# EAGLE board Nixie Test (EAGLE 6.5.0)
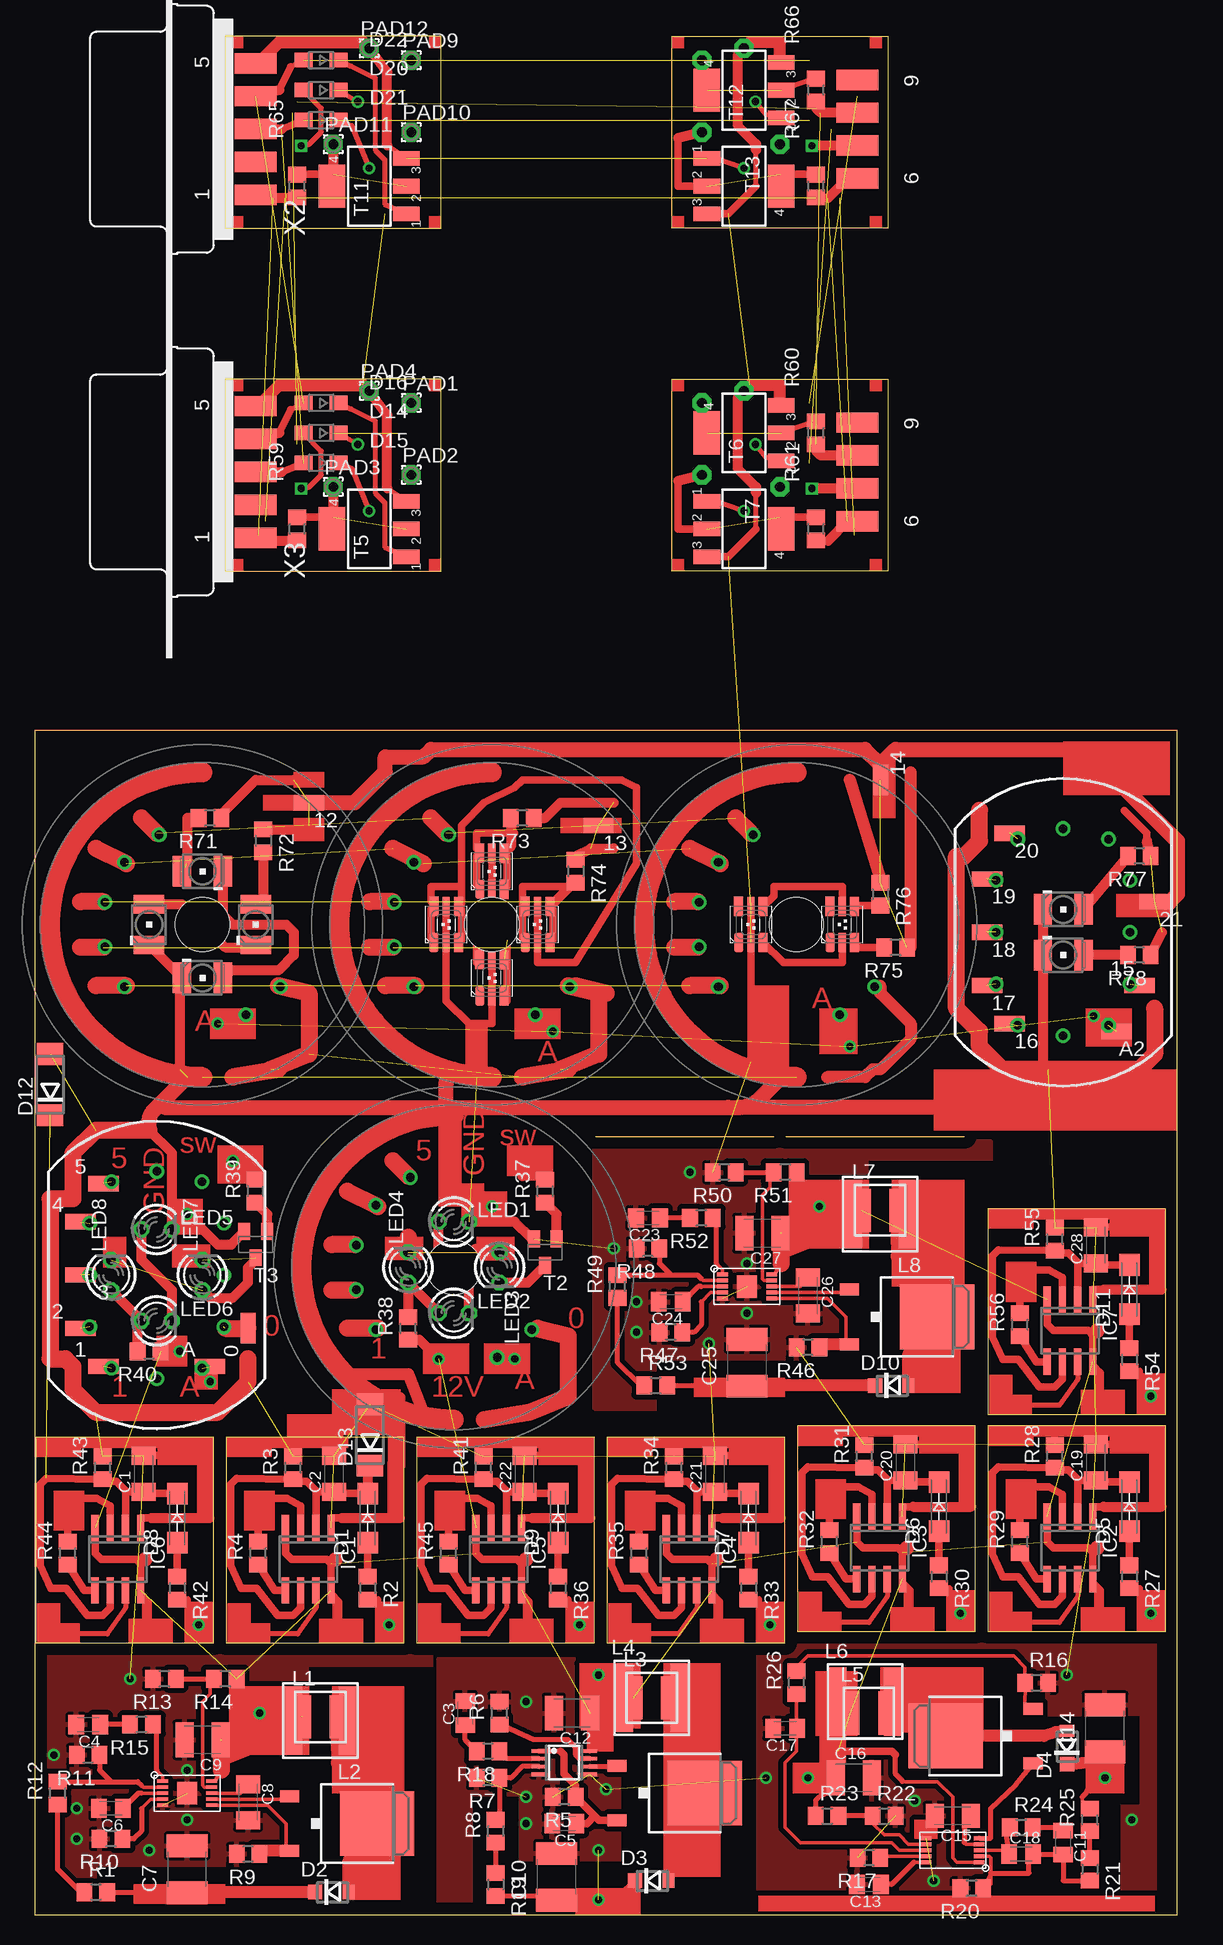
[diagram p17: board, top side]
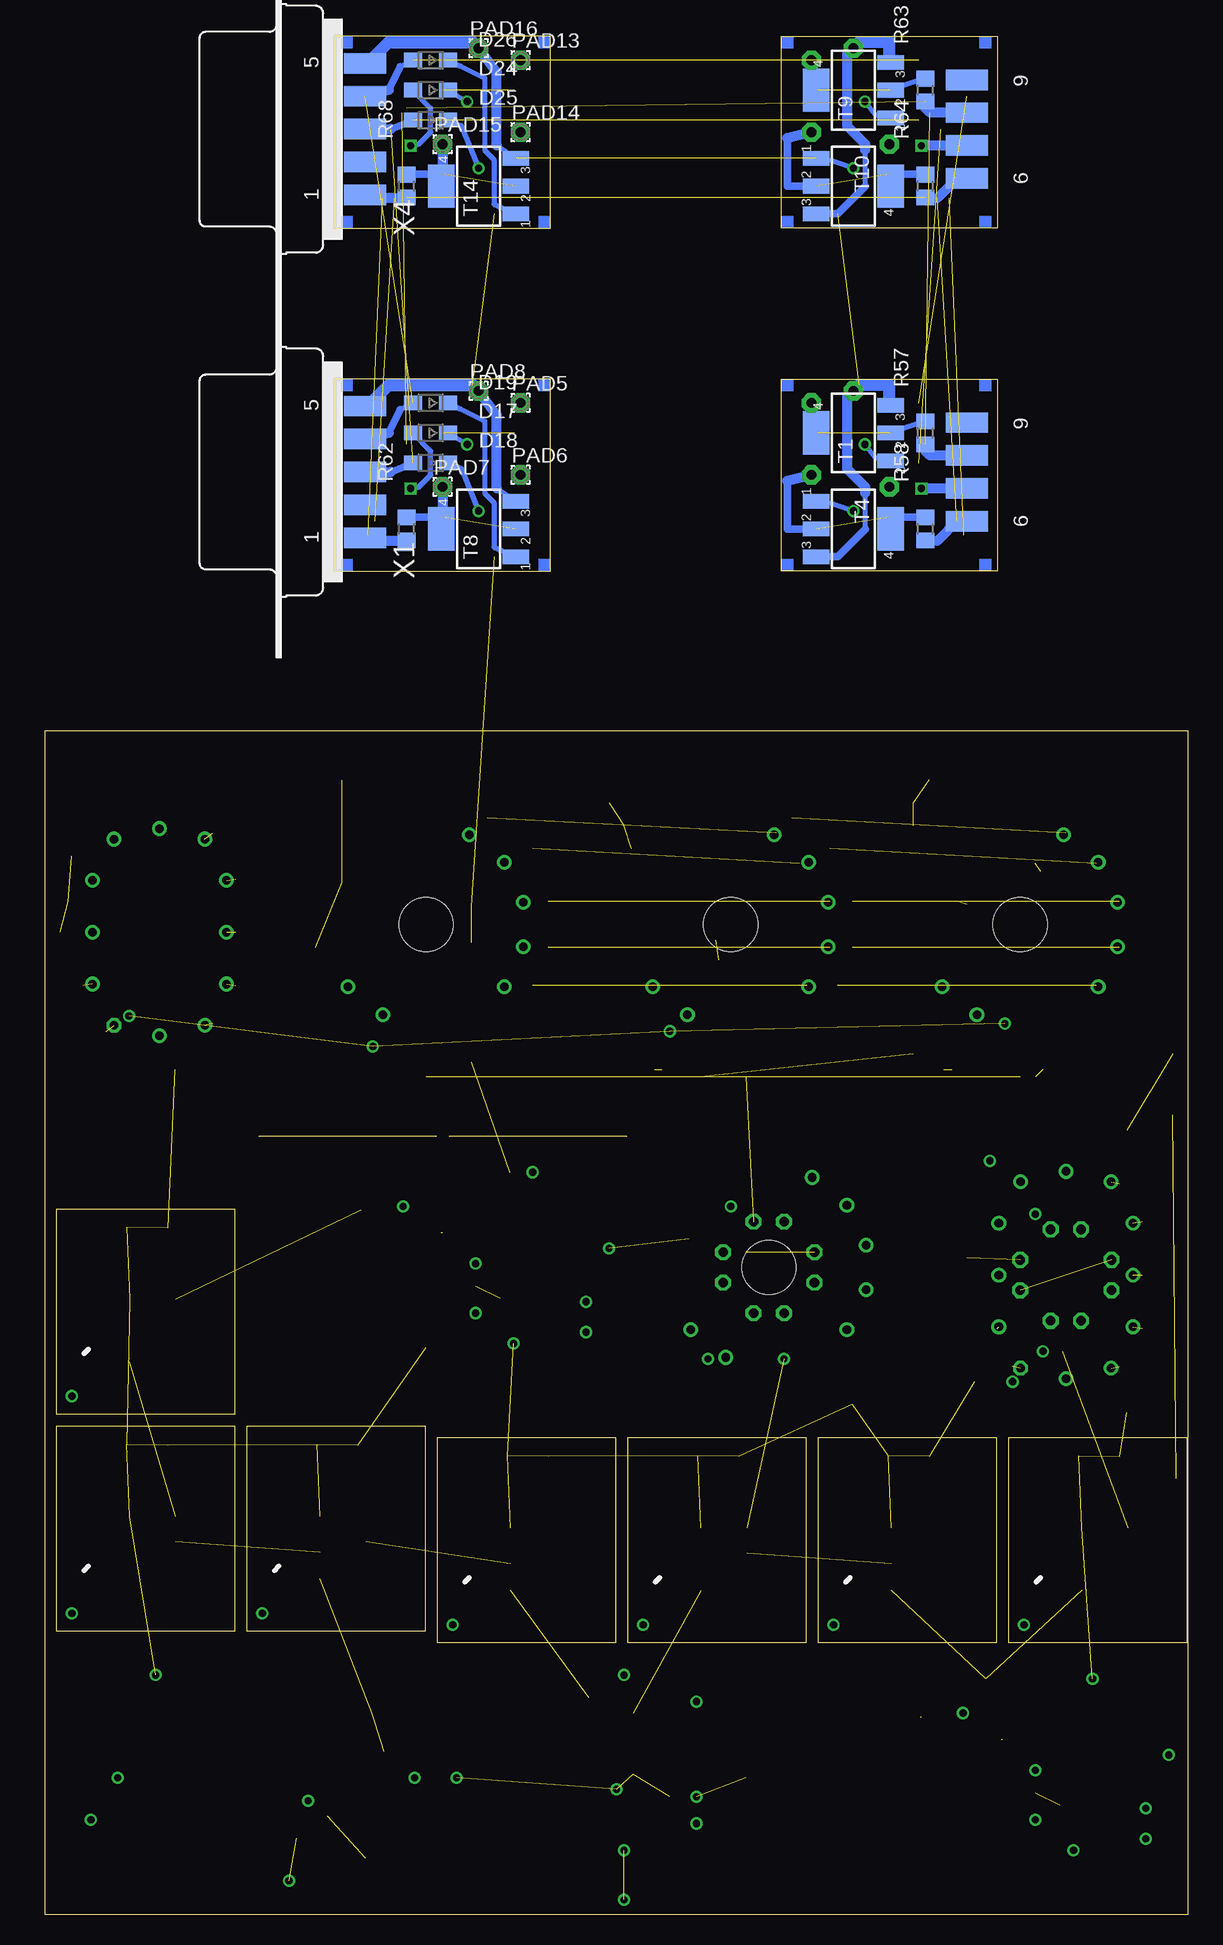
[diagram p18: board, bottom side, seen from below]

Size 95.23 x 156.6 mm. Coordinates in mm from the lower left corner, seen from the top.
Outline: 46.74,64.9 61.59,64.9
Outline: 62.61,64.9 77.47,64.9
Outline: 0,0 95.23,0 95.23,98.73 0,98.73 0,0
Outline: 14.92,39.81 0.06,39.81 0.06,22.67 14.92,22.67 14.92,39.81
Outline: 30.8,39.81 15.94,39.81 15.94,22.67 30.8,22.67 30.8,39.81
Outline: 94.3,40.77 79.44,40.77 79.44,23.62 94.3,23.62 94.3,40.77
Outline: 78.42,40.77 63.56,40.77 63.56,23.62 78.42,23.62 78.42,40.77
Outline: 62.55,39.81 47.69,39.81 47.69,22.67 62.55,22.67 62.55,39.81
Outline: 46.67,39.81 31.81,39.81 31.81,22.67 46.67,22.67 46.67,39.81
Outline: 94.3,58.86 79.44,58.86 79.44,41.72 94.3,41.72 94.3,58.86
Outline: 15.88,112.03 33.88,112.03 33.88,128.03 15.88,128.03 15.88,112.03
Outline: 71.12,112.03 53.12,112.03 53.12,128.03 71.12,128.03 71.12,112.03
Outline: 15.88,140.6 33.88,140.6 33.88,156.6 15.88,156.6 15.88,140.6
Outline: 71.12,140.6 53.12,140.6 53.12,156.6 71.12,156.6 71.12,140.6
Copper layers (1*16): Top 0.035mm / dielectric 1.5mm / Bottom 0.035mm
Design rules "default *": minimum track width 10mil, minimum drill 24mil, track to track 16mil, track to pad 8mil, pad to pad 8mil, via to via 8mil, smd to smd 8mil, copper to edge 40mil, drill to drill 8mil, minimum pad ring 10mil, minimum via ring 8mil, stop-mask expansion 4mil, vias tented up to drill 0mil, thermal gap 10mil
tRestrict: area 5.4,-0.3 to 32.7,12.4; area 22.9,12.1 to 33,20.6; area 36.8,14.6 to 37.8,17.1; area 48.9,0 to 59.4,21.6; area 36.5,-0.3 to 40.3,9.8; area 40.3,2.2 to 49.5,4.4; area 79.4,1.6 to 90.5,16.5; area 89.9,10.5 to 92.1,16.5; area 90.5,9.2 to 92.1,10.5; area 67.9,8.9 to 69.2,13; area 52.1,41.9 to 79.4,54.6; area 69.5,54.3 to 79.7,62.9

## Footprints (pad centres in the part's own frame; a part is rotated, then mirrored left to right if it is on the bottom)
SMD1,27-2,54 = smd 1.27 x 2.54: 1 0,0
C1206K = smd 1.5 x 2: 1 -1.5,0; 2 1.5,0
C0805K = smd 1.3 x 1.6: 1 -1,0; 2 1,0
C1812 = smd 1.9 x 3.4: 1 -1.95,0; 2 1.95,0
C1210K = smd 1.5 x 2.9: 1 -1.5,0; 2 1.5,0
SMA-DO214AC = smd 1.8 x 1.7: A -2.05,0; K 2.05,0
DO219AB = smd 1 x 1.2: A 1.4,0 | smd 1.2 x 1.2: C -1.4,0
DO214AA = smd 1.8 x 2.2: A 2.55,0; C -2.55,0
SOD323-W = smd 1.5 x 1.2: A 1.45,0; C -1.45,0
SO08 = smd 0.6 x 2.2: 1 -1.905,-2.6; 2 -0.635,-2.6; 3 0.635,-2.6; 4 1.905,-2.6; 5 1.905,2.6; 6 0.635,2.6; 7 -0.635,2.6; 8 -1.905,2.6
1616FPS_22UH = smd 1.5 x 3.6: 1 -1.525,0; 2 1.525,0
242408FPS_22UH = smd 1.6 x 5.7: 1 -2.35,0; 2 2.35,0
LED3MM = drill 0.813 octagon: A -1.27,0; K 1.27,0
PLCC6 = smd 0.75 x 1.6: A1 -1.025,-1.5; A2 1.025,-1.5; A3 1.025,1.5; C1 -1.025,1.525 | smd 0.6 x 1.6: C2 0,-1.5; C3 0,1.5
IN-12 = drill 0.711: 0 5.59,-4.32; 1 -3.78,-7.766; 2 -5.59,-4.32; 3 -5.59,0; 4 -5.59,4.32; 5 -3.78,7.766; 6 0,8.64; 7 3.78,7.766; 8 5.59,4.32; 9 5.59,0; LHDP 0,-8.64 | drill 0.711 octagon: A 3.78,-7.766
1,6/0,8 = drill 0.813 pad 1.6 octagon: 1 0,0
TO252 = smd 1 x 1.6: 1 -2.28,-4.8; 2 2.28,-4.8 | smd 5.4 x 6.2: 3 0,2.5
R0805 = smd 1.3 x 1.5: 1 -0.95,0; 2 0.95,0
SOT223 = smd 1.219 x 2.235: 1 -2.311,-3.099; 2 0,-3.099; 3 2.311,-3.099 | smd 3.6 x 2.2: 4 0,3.099
SOT23-BEC = smd 1 x 1.4: B -0.95,-1.1; C 0,1.1; E 0.95,-1.1
MSOP-10 = smd 0.305 x 0.889: 1 -1,-2.045; 2 -0.5,-2.045; 3 0,-2.045; 4 0.5,-2.045; 5 1,-2.045; 6 1,2.045; 7 0.5,2.045; 8 0,2.045; 9 -0.5,2.045; 10 -1,2.045 | smd 1.88 x 1.68: PAD 0,0
MSOP08 = smd 0.3 x 1.2: 1 -0.976,-2.113; 2 -0.326,-2.113; 3 0.324,-2.113; 4 0.974,-2.113; 5 0.974,2.112; 6 0.324,2.112; 7 -0.326,2.112; 8 -0.976,2.112
MSOP-10-NOPAD = smd 0.305 x 0.889: 1 -1,-2.209; 2 -0.5,-2.209; 3 0,-2.209; 4 0.5,-2.209; 5 1,-2.209; 6 1,2.209; 7 0.5,2.209; 8 0,2.209; 9 -0.5,2.209; 10 -1,2.209
ZM1020 = drill 0.711: 1 -6.51,-5.19; 2 -8.12,-1.85; 3 -8.12,1.85; 4 -6.51,5.19; 5 -3.61,7.5; 11 6.51,-5.19; 12 3.61,-7.5 | hole 4.5: 0,0
PLCC2 = smd 2.54 x 1.524: A 0,1.702; C 0,-1.702
F09D = smd 1.7 x 3.5: 1 -5.486,-6.045; 2 -2.743,-6.045; 3 0,-6.045; 4 2.743,-6.045; 5 5.486,-6.045 | smd 1.7 x 3.5 bottom: 6 -4.115,-6.045; 7 -1.372,-6.045; 8 1.372,-6.045; 9 4.115,-6.045

## Placement (x,y rotation side)
0  [SMD1,27-2,54]  17.78,48.9 0 top
1  [SMD1,27-2,54]  5.71,45.72 270 top
2  [SMD1,27-2,54]  3.81,48.9 270 top
3  [SMD1,27-2,54]  3.81,53.34 90 top
4  [SMD1,27-2,54]  3.81,57.78 270 top
5  [SMD1,27-2,54]  5.71,60.96 270 top
12  [SMD1,27-2,54]  22.86,92.71 90 top
13  [SMD1,27-2,54]  46.99,90.81 90 top
14  [SMD1,27-2,54]  70.48,94.61 180 top
15  [SMD1,27-2,54]  92.08,77.47 270 top
16  [SMD1,27-2,54]  81.28,74.3 90 top
17  [SMD1,27-2,54]  79.38,77.47 90 top
18  [SMD1,27-2,54]  79.38,81.92 90 top
19  [SMD1,27-2,54]  79.38,86.36 90 top
20  [SMD1,27-2,54]  81.28,90.17 90 top
21  [SMD1,27-2,54]  93.34,84.45 90 top
A  [SMD1,27-2,54]  14.61,45.72 270 top
A2  [SMD1,27-2,54]  90.17,73.66 90 top
C1  2nF  [C1206K]  9.08,36.77 90 top
C2  2nF  [C1206K]  24.96,36.77 90 top
C3  22nF  [C0805K]  35.88,16.83 90 top
C4  6.8-20nF  [C0805K]  4.45,15.88 180 top
C5  10nF  [C0805K]  44.13,7.62 180 top
C6  100nF  [C0805K]  6.35,8.89 180 top
C7  330nF  [C1812]  12.7,3.81 90 top
C8  4u7  [C1206K]  17.78,9.4 270 top
C9  22uF  [C1210K]  13.97,14.61 180 top
C10  330nF  [C1812]  43.5,3.17 90 top
C11  6.8-20nF  [C0805K]  85.72,6.03 270 top
C12  22uF  [C1210K]  44.77,16.83 180 top
C13  100nF  [C0805K]  69.53,2.54 180 top
C14  330nF  [C1812]  89.22,15.56 90 top
C15  4u7  [C1206K]  76.52,8.26 180 top
C16  22uF  [C1210K]  68.26,11.43 0 top
C17  1nF  [C0805K]  62.55,15.56 180 top
C18  560p  [C0805K]  82.23,5.08 0 top
C19  2nF  [C1206K]  88.46,37.72 90 top
C20  2nF  [C1206K]  72.58,37.72 90 top
C21  2nF  [C1206K]  56.71,36.77 90 top
C22  2nF  [C1206K]  40.83,36.77 90 top
C23  6.8-20nF  [C0805K]  51.12,58.1 180 top
C24  100nF  [C0805K]  53.02,51.12 180 top
C25  330nF  [C1812]  59.37,46.04 90 top
C26  4u7  [C1206K]  64.45,51.63 270 top
C27  22uF  [C1210K]  60.64,56.83 180 top
C28  2nF  [C1206K]  88.46,55.82 90 top
D1  GF1  [SMA-DO214AC]  27.75,33.08 90 top
D2  [DO219AB]  24.77,1.91 0 top
D3  [DO219AB]  51.44,2.86 0 top
D4  [DO219AB]  86.04,13.97 90 top
D5  GF1  [SMA-DO214AC]  91.25,34.04 90 top
D6  GF1  [SMA-DO214AC]  75.37,34.04 90 top
D7  GF1  [SMA-DO214AC]  59.5,33.08 90 top
D8  GF1  [SMA-DO214AC]  11.87,33.08 90 top
D9  GF1  [SMA-DO214AC]  43.62,33.08 90 top
D10  [DO219AB]  71.44,44.13 0 top
D11  GF1  [SMA-DO214AC]  91.25,52.13 90 top
D12  [DO214AA]  1.27,69.22 90 top
D13  [DO214AA]  27.94,40.01 90 top
D14  1N4148  [SOD323-W]  23.88,123.53 180 top
D15  1N4148  [SOD323-W]  23.88,121.03 180 top
D16  1N4148  [SOD323-W]  23.88,126.03 180 top
D17  1N4148  [SOD323-W]  63.12,123.53 180 bottom
D18  1N4148  [SOD323-W]  63.12,121.03 180 bottom
D19  1N4148  [SOD323-W]  63.12,126.03 180 bottom
D20  1N4148  [SOD323-W]  23.88,152.1 180 top
D21  1N4148  [SOD323-W]  23.88,149.6 180 top
D22  1N4148  [SOD323-W]  23.88,154.6 180 top
D24  1N4148  [SOD323-W]  63.12,152.1 180 bottom
D25  1N4148  [SOD323-W]  63.12,149.6 180 bottom
D26  1N4148  [SOD323-W]  63.12,154.6 180 bottom
IC1  NE555D  [SO08]  22.8,29.65 180 top
IC2  NE555D  [SO08]  86.3,30.61 180 top
IC3  NE555D  [SO08]  70.42,30.61 180 top
IC4  NE555D  [SO08]  54.55,29.65 180 top
IC5  NE555D  [SO08]  38.67,29.65 180 top
IC6  NE555D  [SO08]  6.92,29.65 180 top
IC7  NE555D  [SO08]  86.3,48.7 180 top
L1  FPS1616  [1616FPS_22UH]  23.81,16.51 0 top
L2  FPS2424  [242408FPS_22UH]  23.81,16.19 180 top
L3  FPS1616  [1616FPS_22UH]  51.44,18.1 0 top
L4  FPS2424  [242408FPS_22UH]  51.44,18.1 0 top
L5  FPS1616  [1616FPS_22UH]  69.53,16.83 0 top
L6  FPS2424  [242408FPS_22UH]  69.22,17.78 0 top
L7  FPS1616  [1616FPS_22UH]  70.48,58.74 0 top
L8  FPS2424  [242408FPS_22UH]  70.48,58.42 180 top
LED1  [LED3MM]  34.92,57.78 0 top
LED2  [LED3MM]  34.92,50.16 0 top
LED3  [LED3MM]  38.73,53.98 270 top
LED4  [LED3MM]  31.11,53.98 90 top
LED5  [LED3MM]  10.16,57.15 0 top
LED6  [LED3MM]  10.16,49.53 0 top
LED7  [LED3MM]  13.97,53.34 90 top
LED8  [LED3MM]  6.35,53.34 90 top
LED17  LED_PLCC6  [PLCC6]  38.1,87 0 top
LED18  LED_PLCC6  [PLCC6]  38.1,78.11 0 top
LED19  LED_PLCC6  [PLCC6]  41.91,82.55 0 top
LED20  LED_PLCC6  [PLCC6]  34.29,82.55 0 top
LED21  LED_LRTB_G6TG  [PLCC6]  67.31,82.55 0 top
LED22  LED_LRTB_G6TG  [PLCC6]  59.69,82.55 0 top
N1  IN-12A-IN-12  [IN-12]  10.16,53.34 0 top
N3  IN-12A-IN-12  [IN-12]  85.72,81.92 0 top
PAD1  WIREPAD1,6/0,8  [1,6/0,8]  31.38,126.03 0 top
PAD2  WIREPAD1,6/0,8  [1,6/0,8]  31.38,120.03 0 top
PAD3  WIREPAD1,6/0,8  [1,6/0,8]  24.88,119.03 0 top
PAD4  WIREPAD1,6/0,8  [1,6/0,8]  27.88,127.03 0 top
PAD5  WIREPAD1,6/0,8  [1,6/0,8]  55.62,126.03 0 bottom
PAD6  WIREPAD1,6/0,8  [1,6/0,8]  55.62,120.03 0 bottom
PAD7  WIREPAD1,6/0,8  [1,6/0,8]  62.12,119.03 0 bottom
PAD8  WIREPAD1,6/0,8  [1,6/0,8]  59.12,127.03 0 bottom
PAD9  WIREPAD1,6/0,8  [1,6/0,8]  31.38,154.6 0 top
PAD10  WIREPAD1,6/0,8  [1,6/0,8]  31.38,148.6 0 top
PAD11  WIREPAD1,6/0,8  [1,6/0,8]  24.88,147.6 0 top
PAD12  WIREPAD1,6/0,8  [1,6/0,8]  27.88,155.6 0 top
PAD13  WIREPAD1,6/0,8  [1,6/0,8]  55.62,154.6 0 bottom
PAD14  WIREPAD1,6/0,8  [1,6/0,8]  55.62,148.6 0 bottom
PAD15  WIREPAD1,6/0,8  [1,6/0,8]  62.12,147.6 0 bottom
PAD16  WIREPAD1,6/0,8  [1,6/0,8]  59.12,155.6 0 bottom
Q1  N-MOSFET-TO252-DPAK  [TO252]  26.04,7.62 270 top
Q2  N-MOSFET-TO252-DPAK  [TO252]  53.34,10.16 270 top
Q3  N-MOSFET-TO252-DPAK  [TO252]  78.42,14.92 90 top
Q4  N-MOSFET-TO252-DPAK  [TO252]  72.71,49.85 270 top
R1  470k  [R0805]  5.08,1.91 0 top
R2  30k  [R0805]  27.75,27.24 270 top
R3  100k  [R0805]  21.53,37.27 90 top
R4  10k  [R0805]  18.61,30.16 90 top
R5  0.08  [R0805]  44.13,9.84 180 top
R6  39k (400kHz),56k(300kHz)  [R0805]  38.73,16.83 90 top
R7  8.2k (7.96k n.A)  [R0805]  37.78,11.43 180 top
R8  470k  [R0805]  38.42,6.99 90 top
R9  0.08  [R0805]  17.78,5.08 180 top
R10  10k  [R0805]  6.35,6.35 180 top
R11  10k  [R0805]  4.45,13.34 180 top
R12  470k  [R0805]  1.91,10.16 90 top
R13  10k  [R0805]  10.79,19.68 180 top
R14  75k  [R0805]  15.88,19.68 180 top
R15  6.8k-22k  [R0805]  8.89,15.88 180 top
R16  0.08  [R0805]  83.5,19.37 0 top
R17  10k  [R0805]  69.53,4.76 180 top
R18  4.7k  [R0805]  37.78,13.65 180 top
R19  470k  [R0805]  38.42,2.54 270 top
R20  5.1k  [R0805]  78.11,2.22 180 top
R21  470k  [R0805]  87.95,3.81 270 top
R22  10k  [R0805]  70.8,8.26 0 top
R23  75k  [R0805]  66.04,8.26 0 top
R24  6.8k-22k  [R0805]  82.23,7.3 0 top
R25  470k  [R0805]  87.95,7.94 90 top
R26  100  [R0805]  63.5,19.37 90 top
R27  30k  [R0805]  91.25,28.19 270 top
R28  100k  [R0805]  85.03,38.23 90 top
R29  10k  [R0805]  82.11,31.11 90 top
R30  30k  [R0805]  75.37,28.19 270 top
R31  100k  [R0805]  69.15,38.23 90 top
R32  10k  [R0805]  66.23,31.11 90 top
R33  30k  [R0805]  59.5,27.24 270 top
R34  100k  [R0805]  53.28,37.27 90 top
R35  10k  [R0805]  50.36,30.16 90 top
R36  30k  [R0805]  43.62,27.24 270 top
R37  10k  [R0805]  42.55,60.33 90 top
R38  10k  [R0805]  31.11,48.9 90 top
R39  10k  [R0805]  18.41,60.33 90 top
R40  10k  [R0805]  9.53,46.99 180 top
R41  100k  [R0805]  37.4,37.27 90 top
R42  30k  [R0805]  11.87,27.24 270 top
R43  100k  [R0805]  5.65,37.27 90 top
R44  10k  [R0805]  2.73,30.16 90 top
R45  10k  [R0805]  34.48,30.16 90 top
R46  0.08  [R0805]  64.45,47.31 180 top
R47  10k  [R0805]  53.02,48.58 180 top
R48  5.1k  [R0805]  51.12,55.56 180 top
R49  470k  [R0805]  48.58,52.39 90 top
R50  10k  [R0805]  57.47,61.91 180 top
R51  75k  [R0805]  62.55,61.91 180 top
R52  6.8k-22k  [R0805]  55.56,58.1 180 top
R53  470k  [R0805]  51.75,44.13 0 top
R54  30k  [R0805]  91.25,46.29 270 top
R55  100k  [R0805]  85.03,56.32 90 top
R56  10k  [R0805]  82.11,49.21 90 top
R57  [R0805]  21.88,123.53 90 bottom
R58  [R0805]  21.88,115.53 90 bottom
R59  [R0805]  21.88,115.53 90 top
R60  [R0805]  65.12,123.53 90 top
R61  [R0805]  65.12,115.53 90 top
R62  [R0805]  65.12,115.53 90 bottom
R63  [R0805]  21.88,152.1 90 bottom
R64  [R0805]  21.88,144.1 90 bottom
R65  [R0805]  21.88,144.1 90 top
R66  [R0805]  65.12,152.1 90 top
R67  [R0805]  65.12,144.1 90 top
R68  [R0805]  65.12,144.1 90 bottom
R71  10k  [R0805]  14.61,91.44 180 top
R72  10k  [R0805]  19.05,89.53 270 top
R73  10k  [R0805]  40.64,91.44 180 top
R74  10k  [R0805]  45.09,87 270 top
R75  10k  [R0805]  71.75,80.64 180 top
R76  10k  [R0805]  70.48,85.09 270 top
R77  10k  [R0805]  92.08,88.27 180 top
R78  10k  [R0805]  92.08,80.01 180 top
T1  BSP78  [SOT223]  27.88,123.53 90 bottom
T2  [SOT23-BEC]  42.55,55.24 180 top
T3  [SOT23-BEC]  18.41,55.88 180 top
T4  BSP78  [SOT223]  27.88,115.53 270 bottom
T5  BSP78  [SOT223]  27.88,115.53 90 top
T6  BSP78  [SOT223]  59.12,123.53 90 top
T7  BSP78  [SOT223]  59.12,115.53 270 top
T8  BSP78  [SOT223]  59.12,115.53 90 bottom
T9  BSP78  [SOT223]  27.88,152.1 90 bottom
T10  BSP78  [SOT223]  27.88,144.1 270 bottom
T11  BSP78  [SOT223]  27.88,144.1 90 top
T12  BSP78  [SOT223]  59.12,152.1 90 top
T13  BSP78  [SOT223]  59.12,144.1 270 top
T14  BSP78  [SOT223]  59.12,144.1 90 bottom
U1  [MSOP-10]  59.37,52.39 270 top
U2  [MSOP-10]  12.7,10.16 270 top
U3  LM3478  [MSOP08]  44.13,12.7 270 top
U4  [MSOP-10-NOPAD]  76.52,5.4 90 top
U$3  ZM1020  [ZM1020]  34.92,53.98 0 top
U$5  PLCC2  [PLCC2]  13.97,87 90 top
U$6  PLCC2  [PLCC2]  18.41,82.55 0 top
U$7  ZM1020  [ZM1020]  13.97,82.55 0 top
U$8  PLCC2  [PLCC2]  13.97,78.11 270 top
U$9  PLCC2  [PLCC2]  9.53,82.55 0 top
U$10  ZM1020  [ZM1020]  63.5,82.55 0 top
U$11  ZM1020  [ZM1020]  38.1,82.55 0 top
U$12  PLCC2  [PLCC2]  85.72,83.82 270 top
U$13  PLCC2  [PLCC2]  85.72,80.01 270 top
X1  [F09D]  74.62,120.28 90 bottom
X2  [F09D]  12.38,148.85 90 top
X3  [F09D]  12.38,120.28 90 top
X4  [F09D]  74.62,148.85 90 bottom

## Tracks (layer width: path | path; a pad name or v marks a point on that pad's centre or on a via)
+12V  (via drill 0.6)  (17 unrouted)
  Top 0.305: U2.10 14.97,11.16 15.56,12.06 | U4.1 76.88,4.4 76.52,4.76 76.52,9.84 75.25,11.11 72.3,11.11 | 65.09,8.57 R23.1 | U1.10 61.64,53.39 62.23,54.29
  Top 0.406: R14.1 16.84,16.83 15.71,13.2 | L3.1 49.91,17.84 48.58,16.51 46.59,16.51 C12.1 46.24,16.8 U3.8 | 65.72,10.16 65.09,9.53 65.09,8.57 | 72.3,11.11 72.3,11.2 71.75,11.75 71.75,13.34 | R51.1 63.51,59.05 62.38,55.43
  Top 0.61: IC6.4 5.02,30.16 5.52,29.65 8.45,29.65 8.83,29.27 IC6.8 | IC1.4 20.89,30.16 21.4,29.65 24.32,29.65 24.7,29.27 IC1.8 | 71.75,13.34 71.44,13.65 66.99,13.65 66.99,11.66 C16.1 65.72,10.39 65.72,10.16 | IC2.4 84.39,31.11 84.9,30.61 87.82,30.61 88.2,30.23 IC2.8 | IC3.4 68.52,31.11 69.03,30.61 71.94,30.61 72.33,30.23 IC3.8 | IC4.4 52.64,30.16 53.15,29.65 56.07,29.65 56.45,29.27 IC4.8 | IC5.4 36.77,30.16 37.27,29.65 40.2,29.65 40.58,29.27 IC5.8 | IC7.4 84.39,49.21 84.9,48.7 87.82,48.7 88.2,48.32 IC7.8
  Top 0.813: R38.1 32.06,47.95 v33.66,46.35
  Top 1.422: 15.56,12.06 15.56,14.61 15.71,13.2 18.41,14.29 20,16.51 22.23,16.51 | 62.23,54.29 62.23,56.83 62.38,55.43 65.09,56.52 66.67,58.74 68.9,58.74
CTS  (3 unrouted)
  Top 0.61: 65.12,122.03 R60.1 | 65.12,150.6 R66.1
  Top 0.813: X1.8 65.5,121.65 65.12,122.03 | X4.8 65.5,150.23 65.12,150.6
  Bottom 0.61: 21.88,122.03 R57.1 | 21.88,150.6 R63.1
  Bottom 0.813: X3.8 21.5,121.65 21.88,122.03 | X2.8 21.5,150.23 21.88,150.6
DCD  (3 unrouted)
  Top 0.406: 18.66,115.03 X3.1 | 18.66,143.6 X2.1
  Top 0.61: R59.1 21.88,114.53 | R65.1 21.88,143.1
  Top 0.813: 21.88,114.53 19.88,114.53 18.66,115.03 | 21.88,143.1 19.88,143.1 18.66,143.6
  Bottom 0.406: 68.34,115.03 X1.1 | 68.34,143.6 X4.1
  Bottom 0.61: R62.1 65.12,114.53 | R68.1 65.12,143.1
  Bottom 0.813: 65.12,114.53 67.12,114.53 68.34,115.03 | 65.12,143.1 67.12,143.1 68.34,143.6
DSR  (3 unrouted)
  Top 0.61: 66.12,114.53 R61.1 | 66.12,143.1 R67.1
  Top 0.813: X1.6 67.75,116.17 66.12,114.53 | X4.6 67.75,144.74 66.12,143.1
  Bottom 0.61: 20.88,114.53 R58.1 | 20.88,143.1 R64.1
  Bottom 0.813: X3.6 19.24,116.17 20.88,114.53 | X2.6 19.24,144.74 20.88,143.1
DTR  (3 unrouted)
  Top 0.406: D16.A 21.32,125.48 | X3.4 | D22.A 21.32,154.06 | X2.4
  Top 0.61: 21.32,125.48 20.38,123.53 | 21.32,154.06 20.38,152.1
  Top 0.813: 20.38,123.53 X3.4 | 20.38,152.1 X2.4
  Bottom 0.406: D19.A 65.67,125.48 | X1.4 | D26.A 65.67,154.06 | X4.4
  Bottom 0.61: 65.67,125.48 66.62,123.53 | 65.67,154.06 66.62,152.1
  Bottom 0.813: 66.62,123.53 X1.4 | 66.62,152.1 X4.4
GND  (via drill 0.6)  (45 unrouted)
  Top 0.406: U4.6 74.31,7.54 C15.2 | X3.5 19.11,125.77 | T5.3 29.38,118.93 | 60.12,115.53 60.12,118.53 | X2.5 19.11,154.34 | T11.3 29.38,147.51 | 60.12,144.1 60.12,147.1
  Top 0.61: LED18.C3 38.1,74.3 37.47,74.3 | 37.47,74.3 36.83,74.3 | 36.2,74.3 34.29,76.2 LED20.C3 | 37.47,74.3 37.47,69.85 36.83,69.85 36.83,74.3 | 36.83,74.3 36.2,74.3 | 36.2,74.3 36.2,70.48 | LED22.C3 59.69,71.12 | T7.3 57.81,113.22 60.12,115.53 | T13.3 57.81,141.79 60.12,144.1
  Top 0.813: T2.E 41.45,56.34 40.01,57.78 LED1.K | T3.E 16.36,55.88 15.24,55.88 13.97,57.15 LED5.K 11.43,63.5 9.53,65.41 | 12.06,70.48 12.06,78.11 U$8.C U$9.C | U$12.C U$13.C 84.02,70.92 84.45,70.48 | 29.38,118.93 29.38,125.03 PAD4.1 | 60.12,118.53 60.12,119.03 58.62,120.53 58.62,126.53 PAD8.1 | 29.38,147.51 29.38,153.6 PAD12.1 | 60.12,147.1 60.12,147.6 58.62,149.1 58.62,155.1 PAD16.1
  Top 1.016: 19.11,125.77 19.11,126.27 20.38,127.53 27.38,127.53 PAD4.1 | T6.3 62.12,125.84 62.12,127.53 59.62,127.53 PAD8.1 | 19.11,154.34 19.11,154.84 20.38,156.1 27.38,156.1 PAD12.1 | T12.3 62.12,154.42 62.12,156.1 59.62,156.1 PAD16.1
  Top 1.27: 9.53,65.41 9.53,66.15 arc-45 9.9,67.05 12.7,69.85
  Top 1.422: 9.53,65.41 5.08,65.41 3.17,63.5 3.17,59.69 1.27,59.69 1.27,46.35 2.54,46.35 3.17,45.72 3.17,43.81 5.08,41.91 15.24,41.91 17.78,44.45 17.78,46.35
  Bottom 0.406: 26.88,115.53 26.88,118.53 | X1.5 67.88,125.77 | T8.3 57.62,118.93 | 26.88,144.1 26.88,147.1 | X4.5 67.88,154.34 | T14.3 57.62,147.51
  Bottom 0.61: T4.3 29.19,113.22 26.88,115.53 | T10.3 29.19,141.79 26.88,144.1
  Bottom 0.813: 26.88,118.53 26.88,119.03 28.38,120.53 28.38,126.53 PAD4.1 | 57.62,118.93 57.62,125.03 PAD8.1 | 26.88,147.1 26.88,147.6 28.38,149.1 28.38,155.1 PAD12.1 | 57.62,147.51 57.62,153.6 PAD16.1
  Bottom 1.016: T1.3 24.88,125.84 24.88,127.53 27.38,127.53 PAD4.1 | 67.88,125.77 67.88,126.27 66.62,127.53 59.62,127.53 PAD8.1 | T9.3 24.88,154.42 24.88,156.1 27.38,156.1 PAD12.1 | 67.88,154.34 67.88,154.84 66.62,156.1 59.62,156.1 PAD16.1
  other vias: 3.49,6.35 3.49,8.89 1.59,13.34 7.94,19.68 12.7,7.94 12.7,12.06 40.96,17.78 40.96,9.84 40.96,7.62 47.62,10.48 9.53,5.4 46.99,5.4 46.99,1.27 86.04,20 91.44,7.94 60.96,11.43 73.34,9.53 74.93,2.86 50.16,48.58 50.16,51.12 48.26,55.56 54.61,61.91 59.37,50.16 59.37,54.29 56.2,47.62
  pour Top: 0,0 33.02,0 33.02,22.23 0,22.23
  pour Top: 33.66,0 59.37,0 59.37,21.27 33.66,21.27
  pour Top: 60.33,-0.32 93.34,-0.32 93.34,23.5 60.33,23.5
  pour Top: 46.67,42.23 79.69,42.23 79.69,64.45 46.67,64.45
N$1
  Top 0.406: R1.1 3.81,1.91 1.91,3.81 R12.1
N$2
  Top 0.406: IC6.7 7.56,25.59 6.03,23.43 3.62,23.43
N$3
  Top 0.406: 8.83,32.32 8.83,33.08
  Top 0.61: 8.83,33.08 9.72,33.08
  Top 0.813: 9.72,33.08 14.54,33.08
N$4
  Top 0.813: 8.95,26.48 9.34,26.1 9.34,24.32
N$5  (via drill 0.6 pad 0.61)
  other vias: 13.65,24.19
N$6
  Top 0.406: 12,26.35 12.76,26.35 12.76,25.84
N$7
  Top 0.61: 5.65,38.16 5.65,39.31
N$8  (via drill 0.6)
  other vias: 18.73,16.83
N$9
  Top 0.61: 9.34,38.29 10.6,38.29
N$10
  Top 0.61: R2.1 D1.A
N$11
  Top 0.61: R4.1 20,27.05 IC1.5
N$12
  Top 0.61: 27.98,35.13 D1.K 24.96,35.13 C2.1 | IC1.6 22.16,25.59 21.53,24.96 20.26,24.96 18.48,27.24 17.21,27.24 16.32,29.15 16.32,35.88 16.83,36.39 R3.1 21.72,36.13 22.67,36.13 23.54,35.27 C2.1 | C2.1 23.58,35.27 23.43,35.12 IC1.2
  Top 0.813: D13.C 27.75,37.45 D1.K
N$13
  Top 0.61: IC1.3 22.16,34.1 21.02,34.73 18.61,34.73 R4.2
N$14
  Top 0.406: IC1.7 23.43,25.59 21.91,23.43 19.49,23.43
N$15
  pour Top: 19.37,24.19 17.84,25.72 17.21,25.72 17.21,23.3 19.37,23.3
N$16
  Top 0.406: 24.7,32.32 24.7,33.08
  Top 0.61: 24.7,33.08 25.59,33.08
  Top 0.813: 25.59,33.08 30.42,33.08
N$17
  Top 0.813: 24.83,26.48 25.21,26.1 25.21,24.32
N$18  (via drill 0.6 pad 0.61)
  other vias: 29.53,24.19
N$19
  Top 0.305: U2.7 21,9.66 Q1.1
N$20
  Top 0.305: U2.2 9.03,10.66 8.89,10.79
  Top 0.406: R12.2 6.35,11.11 | 6.35,11.11 8.57,11.11 8.89,10.79 | R11.1 5.39,12.06 6.35,11.11
N$21
  Top 0.406: Q1.3 28.54,6.95
  Top 1.016: D2.A 26.16,4.58 28.54,6.95
  Top 1.422: L1.2 25.4,12.7 28.57,9.53 28.57,7.66 Q1.3
N$22
  Top 0.406: R1.2 6.08,1.86 C7.1 12.74,1.91
  Top 1.016: D2.C 12.74,1.91
N$23
  Top 0.305: U2.3 8.89,10.16
  Top 0.406: 8.89,10.16 8.62,10.16 C6.1
N$24
  Top 0.305: U2.4 9.66,9.66 8.89,8.89
  Top 0.406: 8.89,8.89 8.89,6.99 8.26,6.35 R10.1
N$25
  Top 0.305: U2.6 19.41,9.16 20.95,7.62 20.95,5.62 Q1.2
  Top 1.016: Q1.2 18.99,5.34 R9.1
N$26
  Top 0.305: U2.9 14.11,10.66 13.97,10.79 13.97,17.78 14.61,18.41 14.61,19.36 R14.2
  Top 0.406: R13.1 R14.2
N$27
  Top 0.406: R15.2 C4.1
N$28
  Top 0.305: U2.1 10.65,11.57 10.16,12.06
  Top 0.406: 10.16,12.06 10.16,15.55 R15.1
N$29
  Top 0.305: U2.8 17.14,10.16 17.78,10.79 18.18,10.79 C8.1
N$30
  Top 0.406: 27.88,26.35 28.64,26.35 28.64,25.84
N$31
  Top 0.61: 21.53,38.16 21.53,39.31
N$32
  Top 0.61: 25.21,38.29 25.21,40.83
N$33
  Top 0.406: U3.6 48.48,12.38 Q2.1
N$34
  Top 0.406: U3.3 40.63,12.38 39.69,11.43 R7.1 38.73,8.25 R8.2
N$35
  Top 0.406: D3.A 53.15,7.47 Q2.3 55.24,10.16 53.34,12.06 53.34,17.72 L3.2
N$36
  Top 0.406: C10.1 43.13,1.59 R19.2 46.99,1.59 48.9,1.91 D3.C
N$37
  Top 0.406: U3.2 39.36,13.03 R18.1
N$38
  Top 0.406: U3.7 45.39,13.03 45.09,13.34 45.09,13.97 44.45,14.61 41.59,14.61 R6.1
N$39
  Top 0.406: 43.81,13.65 42.04,13.65 U3.1
  Top 0.61: Q2.2 47.05,7.88 46.67,8.25 | 46.67,8.25 R5.1 45.08,10.8 44.13,11.75 44.13,13.34 43.81,13.65 | C5.1 46.04,7.62 46.67,8.25
N$40  (via drill 0.6)
  other vias: 46.99,20
N$41
  Top 0.406: R18.2 35.88,14.61 C3.1
N$42
  Top 0.406: U4.5 79.69,6.4 79.69,8.89 81.77,10.84 Q3.1
N$43
  Top 0.305: 82.96,5.03 C18.2 82.87,5.03 | 87.63,2.86 R21.2 | U4.2 79.56,4.9 79.69,4.76 79.69,3.49 | 79.69,2.54 79.69,3.49 | 79.69,3.49 R20.1
  Top 0.406: 82.96,5.03 C11.2 85.72,2.86 87.63,2.86 | 79.69,3.49 82.87,3.49 82.87,5.03
N$44
  Top 0.406: R8.1 R19.1
N$45
  Top 1.016: 77.79,13.97 74.93,16.83 L5.2 73.38,16.83 Q3.3 84.14,14.92 85.09,15.24 D4.A
N$46
  Top 0.305: 87.31,9.84 87.31,9.21 R25.2
  Top 0.406: C14.1 87.63,10.16 87.31,9.84
  Top 1.016: D4.C 88.08,12.79 C14.1
N$47
  Top 0.305: U4.10 73.3,4.4
  Top 0.406: 73.3,4.4 71.44,2.54 C13.1
N$48
  Top 0.305: U4.9 70.62,4.9
  Top 0.406: 70.62,4.9 R17.1
N$49
  Top 0.305: R26.2 63.5,20.64 64.45,21.59 81.6,21.59 82.55,20.64 R16.1 82.55,17.24 Q3.2
N$50
  Top 0.305: U4.7 72.84,5.9 72.07,6.67 70.8,6.67 69.85,7.62 69.85,8.57 R22.1
  Top 0.406: R22.1 R23.2
N$51
  Top 0.305: 84.82,7.3 C11.1
  Top 0.406: R24.2 84.82,7.3
N$52
  Top 0.305: U4.3 80.6,5.4 C18.1 | 80.92,7.25 R24.1
  Top 0.406: C18.1 80.92,7.25
N$53
  Top 0.305: U4.4 77.61,5.9 77.47,6.03
  Top 0.406: C15.1 78.02,7.85 77.47,7.3 77.47,6.03
N$54
  Top 0.406: R21.1 R25.1
N$55
  Top 0.305: U4.8 72.07,5.4 71.44,6.03 63.82,6.03 62.55,7.3 62.55,12.7 63.5,13.65 63.5,15.51 C17.1 63.5,15.61 R26.1
N$56  (via drill 0.6)
  other vias: 89.22,11.43
N$57  (via drill 0.6)
  other vias: 64.45,11.43
N$58
  Top 0.61: R27.1 D5.A
N$59
  Top 0.61: R29.1 83.5,28.01 IC2.5
N$61
  Top 0.61: 91.49,36.09 D5.K 88.46,36.09 C19.1 | IC2.6 85.66,26.54 85.03,25.91 83.76,25.91 81.98,28.19 80.71,28.19 79.82,30.1 79.82,36.83 80.33,37.34 R28.1 85.22,37.08 86.17,37.08 87.03,36.22 C19.1 | C19.1 87.08,36.22 86.93,36.07 IC2.2
N$62
  Top 0.61: IC2.3 85.66,35.05 84.52,35.69 82.11,35.69 R29.2
N$63
  Top 0.406: IC2.7 86.93,26.54 85.41,24.38 83,24.38
N$64
  pour Top: 82.87,25.15 81.34,26.67 80.71,26.67 80.71,24.26 82.87,24.26
N$65
  Top 0.406: 88.2,33.27 88.2,34.04
  Top 0.61: 88.2,34.04 89.09,34.04
  Top 0.813: 89.09,34.04 93.92,34.04
N$66
  Top 0.813: 88.33,27.43 88.71,27.05 88.71,25.27
N$67  (via drill 0.6 pad 0.61)
  other vias: 93.03,25.15
N$68
  Top 0.406: 91.38,27.3 92.14,27.3 92.14,26.8
N$69
  Top 0.61: 85.03,39.12 85.03,40.26
N$70
  Top 0.61: 88.71,39.24 89.98,39.24
N$71
  Top 0.61: R30.1 D6.A
N$72
  Top 0.61: R32.1 67.63,28.01 IC3.5
N$73
  Top 0.61: 75.61,36.09 D6.K 72.58,36.09 C20.1 | IC3.6 69.79,26.54 69.15,25.91 67.88,25.91 66.1,28.19 64.83,28.19 63.94,30.1 63.94,36.83 64.45,37.34 R31.1 69.34,37.08 70.29,37.08 71.16,36.22 C20.1 | C20.1 71.21,36.22 71.06,36.07 IC3.2
N$74
  pour Top: 3.49,24.19 1.97,25.72 1.33,25.72 1.33,23.3 3.49,23.3
N$75
  Top 0.61: IC3.3 69.79,35.05 68.64,35.69 66.23,35.69 R32.2
N$76
  Top 0.406: IC3.7 71.06,26.54 69.53,24.38 67.12,24.38
N$77
  pour Top: 66.99,25.15 65.47,26.67 64.83,26.67 64.83,24.26 66.99,24.26
N$78
  Top 0.406: 72.33,33.27 72.33,34.04
  Top 0.61: 72.33,34.04 73.22,34.04
  Top 0.813: 73.22,34.04 78.04,34.04
N$79
  Top 0.813: 72.45,27.43 72.83,27.05 72.83,25.27
N$80  (via drill 0.6 pad 0.61)
  other vias: 77.15,25.15
N$81
  Top 0.406: 75.5,27.3 76.26,27.3 76.26,26.8
N$82
  Top 0.61: 69.15,39.12 69.15,40.26
N$83
  Top 0.61: 72.83,39.24 74.11,39.24
N$84
  Top 0.61: R42.1 D8.A
N$85
  Top 0.61: IC6.3 6.29,34.1 5.14,34.73 2.73,34.73 R44.2
N$86
  Top 0.61: R44.1 4.13,27.05 IC6.5
N$87
  Top 0.61: R33.1 D7.A
N$88
  Top 0.61: R35.1 51.75,27.05 IC4.5
N$89
  Top 0.61: 59.74,35.13 D7.K 56.71,35.13 C21.1 | IC4.6 53.91,25.59 53.28,24.96 52.01,24.96 50.23,27.24 48.96,27.24 48.07,29.15 48.07,35.88 48.58,36.39 R34.1 53.47,36.13 54.42,36.13 55.28,35.27 C21.1 | C21.1 55.33,35.27 55.18,35.12 IC4.2
N$90  (1 unrouted)
  Top 0.61: 12.11,35.13 D8.K 9.08,35.13 C1.1 | IC6.6 6.29,25.59 5.65,24.96 4.38,24.96 2.6,27.24 1.33,27.24 0.45,29.15 0.45,35.88 0.95,36.39 R43.1 5.84,36.13 6.79,36.13 7.66,35.27 C1.1 | C1.1 7.71,35.27 7.56,35.12 IC6.2
N$91
  Top 0.813: LED2.K 36.2,52.7 33.66,55.24 LED1.A
N$92  (1 unrouted)
  Top 1.422: LED4.K 31.11,56.52 | LED3.A 36.83,55.24
N$93
  Top 0.813: T2.B 43.49,58.42 R37.1
N$94
  Top 0.813: LED3.K 41.1,52.7 T2.C
N$95
  Top 0.813: LED2.A LED4.A R38.2
N$97  (1 unrouted)
  Top 1.422: 15.88,48.9 0.1
N$98  (1 unrouted)
N$99  (1 unrouted)
N$100  (1 unrouted)
N$101  (1 unrouted)
N$102  (1 unrouted)
N$103  (1 unrouted)
N$104
  Top 0.813: LED6.K 11.43,52.07 8.89,54.61 LED5.A
N$105  (1 unrouted)
  Top 0.813: LED7.A 14.61,51.44 16.51,51.44 17.78,52.7 17.78,53.98 18.41,54.61
N$106
  Top 0.813: T3.B 19.36,58.42 R39.1
N$107  (1 unrouted)
N$108
  Top 0.813: LED8.A LED6.A 8.57,49.22 R40.2
N$109  (via drill 0.6)
  other vias: 40.01,46.35
N$110
  Top 0.813: 42.55,61.59 40.64,61.59 41.91,62.23
N$111
  Top 1.676: 34.92,41.27 arc-180 34.92,66.67
N$112
  Top 1.422: 31.11,61.59 29.84,62.87
N$113
  Top 1.422: 28.57,59.05 26.04,60.33
N$114
  Top 1.422: 26.67,55.88 24.77,55.88
N$115
  Top 1.422: 26.67,52.07 24.77,52.07
N$116
  Top 1.422: 28.57,48.9 26.04,48.9
N$117
  Top 1.422: 41.91,48.9 44.45,48.26 44.45,43.18 41.27,41.91 37.47,41.27
N$118  (via drill 0.6)
  other vias: 38.1,59.05
N$119  (via drill 0.6)
  other vias: 12.06,46.99
N$120  (via drill 0.6)
  other vias: 16.51,62.87
N$121  (via drill 0.6)
  other vias: 12.7,58.42
N$122  (via drill 0.6)
  other vias: 14.61,44.45
N$123
  Top 0.61: IC4.3 53.91,34.1 52.77,34.73 50.35,34.73 R35.2
N$124
  Top 0.406: IC4.7 55.18,25.59 53.66,23.43 51.24,23.43
N$125
  pour Top: 51.12,24.19 49.59,25.72 48.96,25.72 48.96,23.3 51.12,23.3
N$126
  Top 0.406: 56.45,32.32 56.45,33.08
  Top 0.61: 56.45,33.08 57.34,33.08
  Top 0.813: 57.34,33.08 62.17,33.08
N$127
  Top 0.813: 56.58,26.48 56.96,26.1 56.96,24.32
N$128  (via drill 0.6 pad 0.61)
  other vias: 61.28,24.19
N$129
  Top 0.406: 59.63,26.35 60.39,26.35 60.39,25.84
N$130
  Top 0.61: 53.28,38.16 53.28,39.31
N$131
  Top 0.61: 56.96,38.29 58.23,38.29
N$132
  Top 0.61: R36.1 D9.A
N$133
  Top 0.61: R45.1 35.88,27.05 IC5.5
N$134
  Top 0.61: 43.86,35.13 D9.K 40.83,35.13 C22.1 | IC5.6 38.04,25.59 37.4,24.96 36.13,24.96 34.35,27.24 33.08,27.24 32.19,29.15 32.19,35.88 32.7,36.39 R41.1 37.59,36.13 38.54,36.13 39.41,35.27 C22.1 | C22.1 39.46,35.27 39.31,35.12 IC5.2
N$135
  Top 0.61: IC5.3 38.04,34.1 36.89,34.73 34.48,34.73 R45.2
N$136
  Top 0.406: IC5.7 39.31,25.59 37.78,23.43 35.37,23.43
N$137
  pour Top: 35.24,24.19 33.72,25.72 33.08,25.72 33.08,23.3 35.24,23.3
N$138
  Top 0.406: 40.58,32.32 40.58,33.08
  Top 0.61: 40.58,33.08 41.47,33.08
  Top 0.813: 41.47,33.08 46.29,33.08
N$139
  Top 0.813: 40.7,26.48 41.08,26.1 41.08,24.32
N$140  (via drill 0.6 pad 0.61)
  other vias: 45.4,24.19
N$141
  Top 0.406: 43.75,26.35 44.51,26.35 44.51,25.84
N$142
  Top 0.61: 37.4,38.16 37.4,39.31
N$143
  Top 0.61: 41.08,38.29 42.35,38.29
N$144
  Top 0.305: U1.7 67.67,51.89 Q4.1
N$145
  Top 0.305: U1.2 55.7,52.89 55.56,53.02
  Top 0.406: R49.2 53.02,53.34 | 53.02,53.34 55.25,53.34 55.56,53.02 | R48.1 52.07,54.29 53.02,53.34
N$146
  Top 0.406: Q4.3 75.21,49.17
  Top 1.016: D10.A 72.84,46.8 75.21,49.17
  Top 1.422: L7.2 72.07,54.93 75.25,51.75 75.25,49.89 Q4.3
N$147
  Top 0.406: R53.2 52.75,44.09 C25.1 59.42,44.13
  Top 1.016: D10.C 59.42,44.13
N$148
  Top 0.305: U1.3 55.56,52.39
  Top 0.406: 55.56,52.39 55.29,52.39 C24.1
N$149
  Top 0.305: U1.4 56.33,51.89 55.56,51.12
  Top 0.406: 55.56,51.12 55.56,49.21 54.93,48.58 R47.1
N$150
  Top 0.305: U1.6 66.09,51.39 67.63,49.85 67.63,47.85 Q4.2
  Top 1.016: Q4.2 65.66,47.57 R46.1
N$151
  Top 0.305: U1.9 60.78,52.89 60.64,53.02 60.64,60.01 61.28,60.64 61.28,61.59 R51.2
  Top 0.406: R50.1 R51.2
N$152
  Top 0.406: R52.2 C23.1
N$153
  Top 0.305: U1.1 57.33,53.8 56.83,54.29
  Top 0.406: 56.83,54.29 56.83,57.78 R52.1
N$154
  Top 0.305: U1.8 63.82,52.39 64.45,53.02 64.86,53.02 C26.1
N$155
  Top 0.406: R53.1 50.48,44.13 48.58,46.04 R49.1
N$156  (via drill 0.6)
  other vias: 65.41,59.05
N$159
  Top 0.61: R54.1 D11.A
N$160
  Top 0.61: R56.1 83.5,46.1 IC7.5
N$161
  Top 0.61: 91.49,54.18 D11.K 88.46,54.18 C28.1 | IC7.6 85.66,44.64 85.03,44.01 83.76,44.01 81.98,46.29 80.71,46.29 79.82,48.2 79.82,54.93 80.33,55.44 R55.1 85.22,55.18 86.17,55.18 87.03,54.32 C28.1 | C28.1 87.08,54.32 86.93,54.17 IC7.2
N$162
  Top 0.61: IC7.3 85.66,53.15 84.52,53.78 82.11,53.78 R56.2
N$163
  Top 0.406: IC7.7 86.93,44.64 85.41,42.48 83,42.48
N$164
  pour Top: 82.87,43.24 81.34,44.77 80.71,44.77 80.71,42.35 82.87,42.35
N$165
  Top 0.406: 88.2,51.37 88.2,52.13
  Top 0.61: 88.2,52.13 89.09,52.13
  Top 0.813: 89.09,52.13 93.92,52.13
N$166
  Top 0.813: 88.33,45.53 88.71,45.15 88.71,43.37
N$167  (via drill 0.6 pad 0.61)
  other vias: 93.03,43.24
N$168
  Top 0.406: 91.38,45.4 92.14,45.4 92.14,44.9
N$169
  Top 0.61: 85.03,57.21 85.03,58.36
N$170
  Top 0.61: 88.71,57.34 89.98,57.34
N$171
  Top 0.813: 30.48,37.47 30.48,43.18
N$172
  Top 0.813: 29.84,37.47 29.84,40.64
N$173
  Top 1.27: 34.29,66.04 34.29,69.32 arc-45 34.66,70.22 34.92,70.48
N$174
  Top 1.27: 10.79,67.31 57.78,67.31 58.64,67.31 | 58.64,67.31 arc45 60.43,68.05 62.23,69.85 | 81.92,69.85 80.12,68.05 arc-45 78.32,67.31 58.64,67.31
N$175
  Top 1.27: 22.23,92.71 26.67,92.71 29.21,95.25 29.21,96.52 32.38,96.52 33.02,97.16 69.22,97.16 70.48,95.89 71.75,97.16 87.63,97.16 95.25,89.53 95.25,85.09 93.98,83.82
N$176
  Top 1.016: 26.04,45.09 31.11,45.09 32.38,41.91
N$177
  Top 0.406: D16.C 26.38,125.53 28.38,124.53 28.38,118.53 29.16,117.74 29.16,114.03 T5.1
N$178  (via drill 0.6)
  Top 0.406: D15.C 26.43,120.58 v27.88,117.03
  Bottom 0.406: v27.88,117.03 30.79,118.03 T4.1
N$179  (via drill 0.6)
  Top 0.406: D14.C v26.93,122.58
  Bottom 0.406: v26.93,122.58 26.88,122.53 26.09,121.53 T1.1
N$180  (1 unrouted)
  Bottom 0.406: R57.2 21.88,124.53 23.38,124.03 T1.2
  Bottom 0.813: 30.88,123.53 PAD1.1
N$181  (1 unrouted)
  Bottom 0.406: R58.2 21.88,116.53
  Bottom 0.61: 21.88,116.53 24.88,116.53 | 33.38,119.53 33.38,115.53 T4.2
  Bottom 0.813: PAD2.1 33.38,119.53
N$182  (1 unrouted)
  Top 0.406: R59.2 21.88,116.53
  Top 0.61: 21.88,116.53 24.88,116.53
  Top 0.813: PAD3.1 24.88,116.53
N$183  (via drill 0.6)
  Top 0.406: v22.2,118.91 22.38,118.91 22.88,119.03 23.88,120.03 23.88,122.03 D14.A
  Bottom 0.813: X3.7 v22.2,118.91
N$184
  Bottom 0.406: D19.C 60.62,125.53 58.62,124.53 58.62,118.53 57.83,117.74 57.83,114.03 T8.1
N$185  (via drill 0.6)
  Top 0.406: v59.12,117.03 56.21,118.03 T7.1
  Bottom 0.406: D18.C 60.57,120.58 v59.12,117.03
N$186  (via drill 0.6)
  Top 0.406: v60.07,122.58 60.12,122.53 60.91,121.53 T6.1
  Bottom 0.406: D17.C v60.07,122.58
N$187  (1 unrouted)
  Top 0.406: R60.2 65.12,124.53 63.62,124.03 T6.2
  Top 0.813: 56.12,123.53 PAD5.1
N$188  (1 unrouted)
  Top 0.406: R61.2 65.12,116.53
  Top 0.61: 65.12,116.53 62.12,116.53 | 53.62,119.53 53.62,115.53 T7.2
  Top 0.813: PAD6.1 53.62,119.53
N$189  (1 unrouted)
  Bottom 0.406: R62.2 65.12,116.53
  Bottom 0.61: 65.12,116.53 62.12,116.53
  Bottom 0.813: PAD7.1 62.12,116.53
N$190  (via drill 0.6)
  Top 0.813: X1.7 v64.79,118.91
  Bottom 0.406: v64.79,118.91 64.62,118.91 64.12,119.03 63.12,120.03 63.12,122.03 D17.A
N$191
  Top 0.406: D22.C 26.38,154.1 28.38,153.1 28.38,147.1 29.16,146.32 29.16,142.6 T11.1
N$192  (via drill 0.6)
  Top 0.406: D21.C 26.43,149.16 v27.88,145.6
  Bottom 0.406: v27.88,145.6 30.79,146.6 T10.1
N$193  (via drill 0.6)
  Top 0.406: D20.C v26.93,151.16
  Bottom 0.406: v26.93,151.16 26.88,151.1 26.09,150.1 T9.1
N$194  (1 unrouted)
  Bottom 0.406: R63.2 21.88,153.1 23.38,152.6 T9.2
  Bottom 0.813: 30.88,152.1 PAD9.1
N$195  (1 unrouted)
  Bottom 0.406: R64.2 21.88,145.1
  Bottom 0.61: 21.88,145.1 24.88,145.1 | 33.38,148.1 33.38,144.1 T10.2
  Bottom 0.813: PAD10.1 33.38,148.1
N$196  (1 unrouted)
  Top 0.406: R65.2 21.88,145.1
  Top 0.61: 21.88,145.1 24.88,145.1
  Top 0.813: PAD11.1 24.88,145.1
N$197  (via drill 0.6)
  Top 0.406: v22.2,147.48 22.38,147.48 22.88,147.6 23.88,148.6 23.88,150.6 D20.A
  Bottom 0.813: X2.7 v22.2,147.48
N$198
  Bottom 0.406: D26.C 60.62,154.1 58.62,153.1 58.62,147.1 57.83,146.32 57.83,142.6 T14.1
N$199  (via drill 0.6)
  Top 0.406: v59.12,145.6 56.21,146.6 T13.1
  Bottom 0.406: D25.C 60.57,149.16 v59.12,145.6
N$200  (via drill 0.6)
  Top 0.406: v60.07,151.16 60.12,151.1 60.91,150.1 T12.1
  Bottom 0.406: D24.C v60.07,151.16
N$201  (1 unrouted)
  Top 0.406: R66.2 65.12,153.1 63.62,152.6 T12.2
  Top 0.813: 56.12,152.1 PAD13.1
N$202  (1 unrouted)
  Top 0.406: R67.2 65.12,145.1
  Top 0.61: 65.12,145.1 62.12,145.1 | 53.62,148.1 53.62,144.1 T13.2
  Top 0.813: PAD14.1 53.62,148.1
N$203  (1 unrouted)
  Bottom 0.406: R68.2 65.12,145.1
  Bottom 0.61: 65.12,145.1 62.12,145.1
  Bottom 0.813: PAD15.1 62.12,145.1
N$204  (via drill 0.6)
  Top 0.813: X4.7 v64.79,147.48
  Bottom 0.406: v64.79,147.48 64.62,147.48 64.12,147.6 63.12,148.6 63.12,150.6 D24.A
N$219
  Top 0.813: U$5.C 15.67,83.39 16.51,82.55 20.95,82.55 21.59,81.92 21.59,80.01 20.32,78.74 16.31,78.74 U$8.A
N$220
  Top 0.813: U$9.A 12.27,84.25 15.88,80.64 18.21,80.64 U$6.C
N$221  (1 unrouted)
  Top 0.813: R72.2 19.05,84.45
N$222  (1 unrouted)
  Top 0.813: R71.2 12.7,91.44 12.7,87.63
N$223  (2 unrouted)
  Top 0.813: R71.1 15.55,91.75 18.41,94.61 21.59,94.61 | R72.1 22.54,90.48 22.86,90.81
N$224  (1 unrouted)
  Top 0.61: 36.83,79.38 36.83,81.28 39.37,81.28 | LED17.C3 38.1,82.55 39.37,81.28 | 39.37,81.28 39.37,76.2
N$225
  Top 0.61: LED19.C3 41.91,79.38 45.09,79.38 50.16,87.63 50.16,93.98 48.9,94.61 40.64,94.61 40.01,93.98 37.47,92.71 35.56,90.81 35.56,84.3 LED20.A3
N$226
  Top 0.813: R74.2 44.93,86.05 LED19.A3
N$227
  Top 0.813: R73.2 39.69,89.06 LED17.A3
N$228  (2 unrouted)
  Top 0.813: R74.1 45.09,88.27 46.35,88.9 48.26,88.9 | R73.1 42.55,91.44 43.81,92.71 48.26,92.71
N$229
  Top 0.61: LED21.C2 67.31,79.38 62.39,79.38 LED22.A2
N$230
  Top 0.61: LED21.C3 67.31,85.72 61.59,85.72 61.59,84.93 LED22.A3
N$231
  Top 0.61: R76.2 68.42,84.14 LED21.A3
N$232
  Top 0.61: R75.2 68.74,80.64 LED21.A2
N$233  (2 unrouted)
N$234  (1 unrouted)
N$235  (1 unrouted)
N$236  (1 unrouted)
N$237  (1 unrouted)
N$238  (1 unrouted)
N$239  (1 unrouted)
N$240  (1 unrouted)
N$241
  Top 0.813: R78.2 U$13.A
N$242
  Top 0.813: R77.2 U$12.A
N$243  (2 unrouted)
  Top 0.61: 92.71,89.53 92.71,90.17 90.81,92.08
  Top 0.813: R77.1 92.71,89.53 | R78.1 93.98,81.92
N$244  (via drill 0.6)  (3 unrouted)
  other vias: 15.24,74.3 43.18,73.66 67.94,72.39 88.27,74.93
N$246  (2 unrouted)
  Top 1.676: 13.97,69.85 arc-180 13.97,95.25 | 38.1,69.85 arc-180 38.1,95.25 | 63.5,69.85 arc-180 63.5,95.25
N$247  (2 unrouted)
  Top 1.422: 10.16,90.17 8.89,91.44 | 34.29,90.17 33.02,91.44 | 59.69,90.17 58.42,91.44
N$248  (2 unrouted)
  Top 1.422: 7.62,87.63 5.08,88.9 | 32.38,87.63 29.84,88.9 | 57.15,87.63 54.61,88.9
N$249  (2 unrouted)
  Top 1.422: 5.71,84.45 3.81,84.45 | 29.84,84.45 27.94,84.45 | 55.24,84.45 53.34,84.45
N$250  (2 unrouted)
  Top 1.422: 5.71,80.64 3.81,80.64 | 29.84,80.64 27.94,80.64 | 55.24,80.64 53.34,80.64
N$251  (2 unrouted)
  Top 1.422: 7.62,77.47 5.08,77.47 | 31.75,77.47 29.21,77.47 | 57.15,77.47 54.61,77.47
N$252  (4 unrouted)
  Top 1.422: 20.32,77.47 22.86,76.83 22.86,71.75 19.68,70.48 | 20.32,70.48 16.51,69.85 | 45.09,77.47 47.62,76.83 | 43.81,70.48 46.99,71.75 46.99,76.83 44.45,77.47 | 44.45,70.48 40.64,69.85
N$258
  Top 0.61: 39.37,88.27 39.37,85.72
N$259
  Top 0.61: 36.83,88.27 36.83,85.72
N$260
  Top 0.61: 43.18,83.82 43.18,81.28
N$261
  Top 0.61: 40.64,81.28 40.64,85.72 44.45,85.72
N$262
  Top 0.61: 35.56,83.82 35.56,81.28
N$263
  Top 0.61: 33.02,83.82 33.02,81.28
N$264
  Top 0.61: 36.83,88.9 36.83,90.17 40.01,90.17
N$265
  Top 0.61: 33.02,84.45 33.02,85.72 35.56,85.72 35.56,84.45
N$266
  Top 1.016: 70.48,77.47 70.48,76.83 73.03,74.3 73.03,73.03 70.48,70.48 69.85,70.48 69.22,69.85 66.04,69.85
N$267
  Top 1.016: 73.03,80.64 73.03,95.25
N$268
  Top 1.016: 70.48,86.36 67.94,94.61
N$269
  Top 1.422: 93.34,75.56 93.34,71.75 92.08,70.48 80.64,70.48 78.74,72.39 78.74,73.66 76.83,75.56 76.83,88.27 77.47,88.27 78.74,89.53 78.74,92.08
RTS  (3 unrouted)
  Top 0.61: 20.57,120.28 D15.A | 20.57,148.85 D21.A
  Top 0.813: X3.3 20.57,120.28 | X2.3 20.57,148.85
  Bottom 0.61: 66.42,120.28 D18.A | 66.42,148.85 D25.A
  Bottom 0.813: X1.3 66.42,120.28 | X4.3 66.42,148.85
(copper drawn outside any net)
  shapes: Bottom area x16, Top area x133, Top circle x7

## Text on the board
Top: A | A | A | sw | sw | 5 | 5 | GND | GND | 0 | 0 | 1 | A | 1 | A | 12V